# EAGLE design SparkFun_Dev_ESP32_C3_MINI (EAGLE 9.6.2)
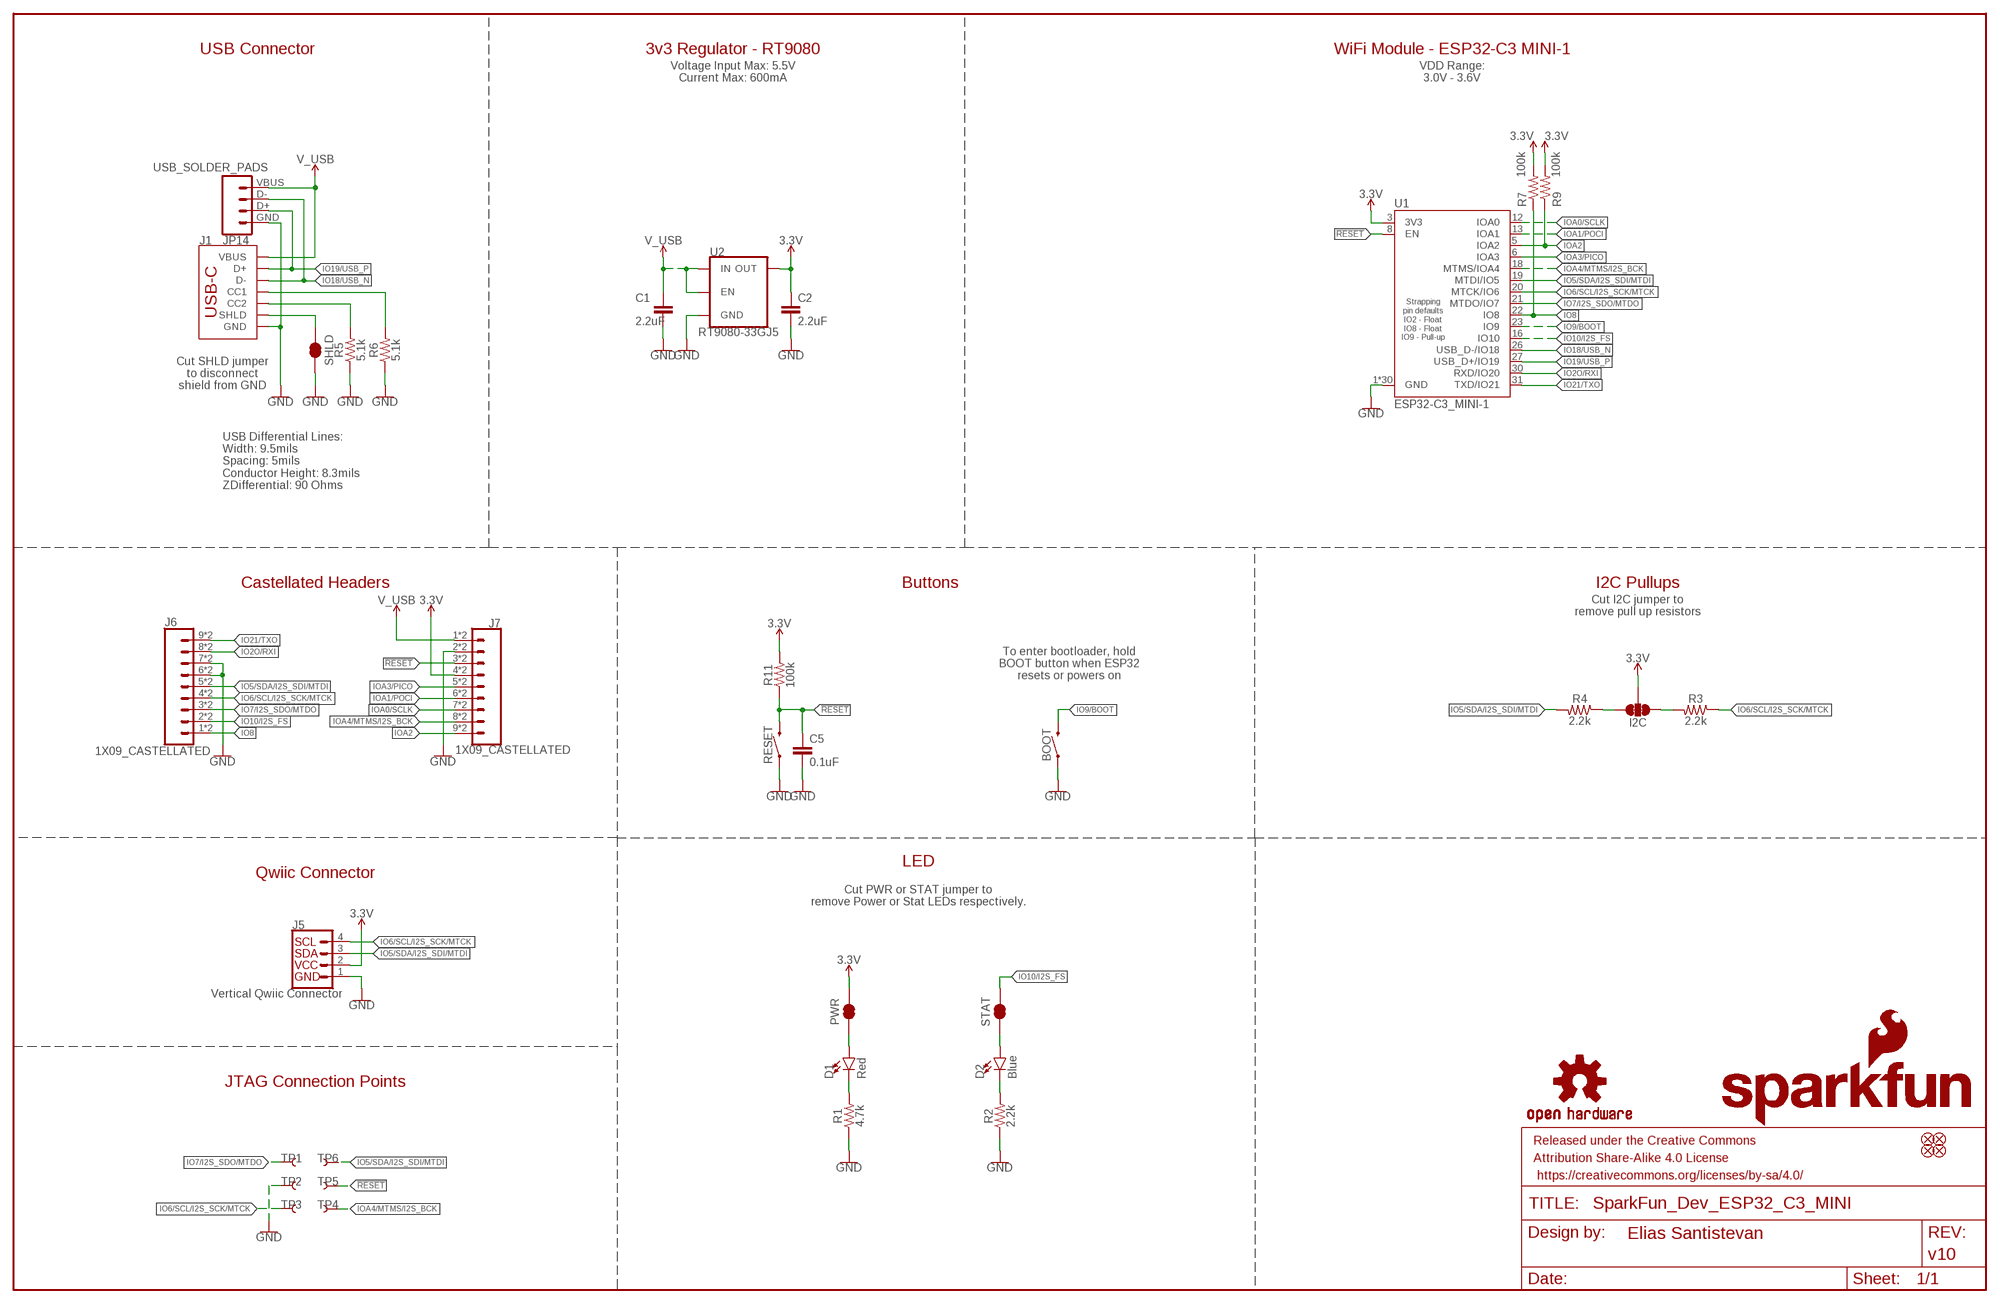
[diagram p0: schematic, sheet 1]

## Parts
BOOT  MOMENTARY-SWITCH-SPST-SMD-4.6X2.8MM  [TACTILE_SWITCH_SMD_4.6X2.8MM]
C1  2.2uF  2.2UF-0402_TIGHT-10V-10%-X5R  [0402-TIGHT]
C2  2.2uF  2.2UF-0402_TIGHT-10V-10%-X5R  [0402-TIGHT]
C5  0.1uF  0.1UF-0402T-6.3V-10%-X7R  [0402-TIGHT]
D1  Red  LED-RED_0603-KB  [LED-0603]
D2  Blue  LED-BLUE0603  [LED-0603]
FD1  FIDUCIALUFIDUCIAL  [FIDUCIAL-MICRO]
FD2  FIDUCIALUFIDUCIAL  [FIDUCIAL-MICRO]
FD3  FIDUCIALUFIDUCIAL  [FIDUCIAL-MICRO]
FD4  FIDUCIALUFIDUCIAL  [FIDUCIAL-MICRO]
FRAME2  FRAME-LEDGER  [CREATIVE_COMMONS]
I2C  JUMPER-SMT_3_2-NC_TRACE_SILK  [SMT-JUMPER_3_2-NC_TRACE_SILK]
J1  USB Female Type C Connector  USB_C_4-LAYER_PADS  [USB-C-16P_4LAYER-PADS]
J5  Vertical Qwiic Connector  QWIIC_CONNECTOR  [JST04_1MM_VERT]
J6  1X09_CASTELLATED  [1X09_CASTELLATED]
J7  1X09_CASTELLATED  [1X09_CASTELLATED]
JP14  USB_SOLDER_PADS  [USB-SOLDER-PADS]
LOGO1  SFE_LOGO_NAME_FLAMEBLANK  [BLANK]
LOGO3  OSHW-LOGOS  [OSHW-LOGO-S]
PWR  JUMPER-SMT_2_NC_TRACE_SILK  [SMT-JUMPER_2_NC_TRACE_SILK]
R1  4.7k  4.7KOHM-0402T-1/16W-1%  [0402-TIGHT]
R2  2.2k  2.2KOHM-0402T-1/16W-1%  [0402-TIGHT]
R3  2.2k  2.2KOHM-0402T-1/16W-1%  [0402-TIGHT]
R4  2.2k  2.2KOHM-0402T-1/16W-1%  [0402-TIGHT]
R5  5.1k  5.1KOHM-0402T-1/16W-1%  [0402-TIGHT]
R6  5.1k  5.1KOHM-0402T-1/16W-1%  [0402-TIGHT]
R7  100k  100KOHM-0402T-1/16W-1%  [0402-TIGHT]
R9  100k  100KOHM-0402T-1/16W-1%  [0402-TIGHT]
R11  100k  100KOHM-0402T-1/16W-1%  [0402-TIGHT]
RESET  MOMENTARY-SWITCH-SPST-SMD-4.6X2.8MM  [TACTILE_SWITCH_SMD_4.6X2.8MM]
SHLD  JUMPER-SMT_2_NC_TRACE_SILK  [SMT-JUMPER_2_NC_TRACE_SILK]
STAT  JUMPER-SMT_2_NC_TRACE_SILK  [SMT-JUMPER_2_NC_TRACE_SILK]
TP1  TEST-POINT3X5  [PAD.03X.05]
TP2  TEST-POINT3X5  [PAD.03X.05]
TP3  TEST-POINT3X5  [PAD.03X.05]
TP4  TEST-POINT3X5  [PAD.03X.05]
TP5  TEST-POINT3X5  [PAD.03X.05]
TP6  TEST-POINT3X5  [PAD.03X.05]
U1  ESP32-C3_MINI-1  [ESP32-C3-MINI-1]
U2  RT9080-33GJ5  V_REG_RT9080  [SOT23-5]

## Nets
3.3V: C2.1 I2C.2 J5.2 J7.4 J7.4B PWR.2 R7.2 R9.2 R11.2 U1.3(3V3) U2.5(OUT)
!RESET!: C5.1 J7.3 J7.3B R11.1 RESET.3 RESET.4 TP5.1 U1.8(EN)
GND: BOOT.1 BOOT.2 C1.2 C2.2 C5.2 J1.GND J1.GND2(GND) J5.1 J6.6 J6.6B J6.7 J6.7B J7.2 J7.2B JP14.GND R1.1 R2.1 R5.1 R6.1 RESET.1 RESET.2 SHLD.2 TP2.1 U1.1(GND) U1.2(GND) U1.11(GND) U1.14(GND) U1.36(GND) U1.37(GND) U1.38(GND) U1.39(GND) U1.40(GND) U1.41(GND) U1.42(GND) U1.43(GND) U1.44(GND) U1.45(GND) U1.46(GND) U1.47(GND) U1.48(GND) U1.49.1(GND) U1.49.2(GND) U1.49.3(GND) U1.49.4(GND) U1.49.5(GND) U1.49.6(GND) U1.49.7(GND) U1.49.8(GND) U1.49.9(GND) U1.50(GND) U1.51(GND) U1.52(GND) U1.53(GND) U2.2(GND)
IO2O/RXI: J6.8 J6.8B U1.30(RXD/IO20)
IO5/SDA/I2S_SDI/MTDI: J5.3 J6.5 J6.5B R4.2 TP6.1 U1.19(MTDI/IO5)
IO6/SCL/I2S_SCK/MTCK: J5.4 J6.4 J6.4B R3.1 TP3.1 U1.20(MTCK/IO6)
IO7/I2S_SDO/MTDO: J6.3 J6.3B TP1.1 U1.21(MTDO/IO7)
IO8: J6.1 J6.1B R7.1 U1.22(IO8)
IO9/BOOT: BOOT.3 BOOT.4 U1.23(IO9)
IO10/I2S_FS: J6.2 J6.2B STAT.2 U1.16(IO10)
IO18/USB_N [USB]: J1.A7(D-) J1.B7(D-) JP14.D- U1.26(USB_D-/IO18)
IO19/USB_P [USB]: J1.A6(D+) J1.B6(D+) JP14.D+ U1.27(USB_D+/IO19)
IO21/TXO: J6.9 J6.9B U1.31(TXD/IO21)
IOA0/SCLK: J7.7 J7.7B U1.12(IOA0)
IOA1/POCI: J7.6 J7.6B U1.13(IOA1)
IOA2: J7.9 J7.9B R9.1 U1.5(IOA2)
IOA3/PICO: J7.5 J7.5B U1.6(IOA3)
IOA4/MTMS/I2S_BCK: J7.8 J7.8B TP4.1 U1.18(MTMS/IOA4)
N$1: D1.C R1.2
N$2: D1.A PWR.1
N$3: D2.C R2.2
N$4: I2C.3 R3.2
N$5: I2C.1 R4.1
N$7: J1.B5(CC2) R5.2
N$8: J1.A5(CC1) R6.2
N$11: D2.A STAT.1
SHLD: J1.SHLD1(SHLD) J1.SHLD2(SHLD) J1.SHLD3(SHLD) J1.SHLD4(SHLD) SHLD.1
V_USB: C1.1 J1.VBUS1(VBUS) J1.VBUS2(VBUS) J7.1 J7.1B JP14.VBUS U2.1(IN) U2.3(EN)

## Notes on the sheet
- USB Connector | 3v3 Regulator - RT9080 | WiFi Module - ESP32-C3 MINI-1
- Voltage Input Max: 5.5V
  Current Max: 600mA
- VDD Range:
  3.0V - 3.6V
- Cut SHLD jumper
  to disconnect
  shield from GND
- USB Differential Lines:  
  Width: 9.5mils
  Spacing: 5mils
  Conductor Height: 8.3mils
  ZDifferential: 90 Ohms
- Castellated Headers | Buttons | I2C Pullups
- Cut I2C jumper to
  remove pull up resistors
- To enter bootloader, hold
  BOOT button when ESP32
  resets or powers on
- LED
- Qwiic Connector
- Cut PWR or STAT jumper to
  remove Power or Stat LEDs respectively.
- JTAG Connection Points

## Library data of the parts
BOOT RESET = SparkFun-Switches:MOMENTARY-SWITCH-SPST: Momentary Switch (Pushbutton) - SPST Normally-open (NO) SPST momentary switches (buttons, pushbuttons). Variants PTH-12MM - 12mm square, through-hole Momentary Pushbutton Switch - 12mm Square <https://www.sparkfun.com/products/9190> (COM-09190) PTH-6.0MM, PTH-6.0MM-KIT - 6.0mm square, through-hole Mini Pushbutton Switch <https://www.sparkfun.com/products/97> (COM-00097) KIT package intended for soldering kit's - only one side of pads' copper is exposed. PTH-RIGHT-ANGLE-KIT - Right-angle, through-hole Right Angle Tactile Button <https://www.sparkfun.com/products/10791> - Used on SparkFun BigTime Watch Kit <https://www.sparkfun.com/products/11734> SMD-12MM - 12mm square, surface-mount Tactile Button - SMD (12mm) <https://www.sparkfun.com/products/12993> (COM-12993) Used on SparkFun PicoBoard <https://www.sparkfun.com/products/11888> SMD-4.5MM - 4.5mm Square Trackball Switch Used on SparkFun Blackberry Trackballer Breakout <https://www.sparkfun.com/products/13169> SMD-4.6MMX2.8MM - 4.60mm x 2.80mm, surface mount Used on SparkFun Pro Micro - RP2040 <https://www.sparkfun.com/products/17717> SMD-5.2MM, SMD-5.2-REDUNDANT - 5.2mm square, surface-mount Mini Pushbutton Switch - SMD <https://www.sparkfun.com/products/8720> (COM-08720) Used on Arduino Pro Mini <https://www.sparkfun.com/products/11114> REDUNDANT package connects both switch circuits together SMD-6.0X3.5MM - 6.0 x 3.5mm, surface mount Momentary Reset Switch SMD <https://www.sparkfun.com/products/8229> (COM-08229) SMD-6.2MM-TALL - 6.2mm square, surface mount Tactile Button - SMD (6mm) <https://www.sparkfun.com/products/12992> Used on SparkFun Digital Sandbox <https://www.sparkfun.com/products/12651> SMD-RIGHT-ANGLE - Right-angle, surface mount Used on SparkFun Block for Intel® Edison - Arduino <https://www.sparkfun.com/products/13036>; PROD_ID: SWCH-15606
C1 C2 = SparkFun-Capacitors:2.2UF: 2.2µF ceramic capacitors A capacitor is a passive two-terminal electrical component used to store electrical energy temporarily in an electric field.; PROD_ID: CAP-14232
C5 = SparkFun-Capacitors:0.1UF: 0.1µF ceramic capacitors A capacitor is a passive two-terminal electrical component used to store electrical energy temporarily in an electric field.; PROD_ID: CAP-14993
D1 = SparkFun-LED:LED-RED: Red SMD LED Used in manufacturing of most products at SparkFun Packages: 0603 - KB - KingBright (DIO-17976) SMD 0603 package [Datasheet] <https://www.kingbrightusa.com/images/catalog/SPEC/APT1608SURCK.pdf> 0603 - (DIO-00819, has gone EOL) SMD 0603 package 0603 SMART - SMD 0603 SMART package ( more efficient and expensive)[Product Link] <http://www.osram-os.com/Graphics/XPic2/00077099_0.pdf> 1206 - SMD1206 package [Product Link] <https://www.sparkfun.com/datasheets/DevTools/LilyPad/Q150OVS4.pdff> SparkFun Products: Pro Mini 328 -5V <https://www.sparkfun.com/products/821> RedBoard <https://www.sparkfun.com/products/12757> IOIO-OTG <https://www.sparkfun.com/products/13613>; PROD_ID: DIO-17976
D2 = SparkFun-LED:LED-BLUE: Blue SMD LED Used in manufacturing of various products at SparkFun Packages: 0603 - SMD 0603 package [Product Link] <http://www.digikey.com/product-detail/en/SMLE12BC7TT86/511-1589-2-ND/1641808> 1206 - SMD1206 package [Product Link] <http://www.digikey.com/product-detail/en/lite-on-inc/LTST-C150TBKT/160-1643-1-ND/573584> SparkFun Products: ESP8266 Thing-Dev Board <https://www.sparkfun.com/products/13711> RedBoard <https://www.sparkfun.com/products/12757>; PROD_ID: DIO-08575
FD1-FD4 = SparkFun-Aesthetics:FIDUCIAL: Fiducial Alignment Points Point-of-reference for pick-and-place machines and other optical instruments.
FRAME2 = SparkFun-Aesthetics:FRAME-LEDGER: Schematic Frame - Ledger Standard 11x14 US Ledger frame; DESIGNER: Elias Santistevan; REV: v10
I2C = SparkFun-Jumpers:JUMPER-SMT_3_2-NC_TRACE: Normally closed trace jumper (2 of 2 connections) This jumper has a trace between all three pads so they are normally closed (NC). Use a razor knife to open the connection(s). For best results follow the IPC guidelines for cutting traces: Cutout at least 0.063 mm (0.005 in). Remove all loose material to clean up the cut area. Seal the cut with an approved epoxy. Reapply solder to reclose the connection(s).
J1 = SparkFun-Connectors:USB_C: USB Type C 16Pin Connector Super Speed pins not available on the 16-pin purely SMD connector so this part is best for USB 2.0 implementations. D1 and D2 are tied together enabling D+/- no matter which way the cable is plugged into the connector. The two channel configuration pins (CC1/2) are exposed. These are normally connected to ground via 5.1k resistors but can be reconfigured for high current/high power applications. **4-LAYER BOARD WARNING!!** If designing 4-layer board, make sure to select the variant _4-LAYER-ISOLATED. The linked footprint (USB-C-16-4LAYER-ISOLATED) includes some very necessary cutout polygons in the inner layers (2 and 15). This prevents the PTH mounting shield legs on the USB connector from electrically connecting any other polygons on the inner layers (usually VCC and GND).; PROD_ID: CONN-14122
J5 = SparkFun-Connectors:QWIIC_CONNECTOR: SparkFun I2C Standard Qwiic Connector An SMD 1mm pitch JST connector makes it easy and quick (get it? Qwiic?) to connect I2C devices to each other. The Qwiic system <http://www.sparkfun.com/qwiic> enables fast and solderless connection between popular platforms and various sensors and actuators. We carry 200mm <https://www.sparkfun.com/products/14204>, 100mm <https://www.sparkfun.com/products/14205>, 50mm <https://www.sparkfun.com/products/14206>, and breadboard friendly <https://www.sparkfun.com/products/14207> Qwiic cables. We also offer 10 pcs strips <https://www.sparkfun.com/products/14323> the SMD connectors.; PROD_ID: CONN-14483
J6 J7 = ESP32-C3-MINI-1:1X09_CASTELLATED
JP14 = SparkFun-Connectors:USB_SOLDER_PADS: Solder pad access to USB pins. Helpful to expose on PCBs so user can attach external USB connector if necessary.
LOGO1 = SparkFun-Aesthetics:SFE_LOGO_NAME_FLAME: SparkFun Font Logo w/ Flame This is the SparkFun full logo. The logo on the schematic will always be the same size; the package variant is the height of the flame part of the logo. Default layer for the logo on the board is tSilk.
LOGO3 = SparkFun-Aesthetics:OSHW-LOGO: Open-Source Hardware (OSHW) Logo This logo indicates the piece of hardware it is found on incorporates a OSHW license and/or adheres to the definition of open source hardware found here: http://freedomdefined.org/OSHW
PWR SHLD STAT = SparkFun-Jumpers:JUMPER-SMT_2_NC_TRACE: Normally closed trace jumper This jumper has a trace between two pads so it's normally closed (NC). Use a razor knife to open the connection. For best results follow the IPC guidelines for cutting traces: Cutout at least 0.063 mm (0.005 in). Remove all loose material to clean up the cut area. Seal the cut with an approved epoxy. Reapply solder to reclose the connection.
R1 = SparkFun-Resistors:4.7KOHM: 4.7kΩ resistor A resistor is a passive two-terminal electrical component that implements electrical resistance as a circuit element. Resistors act to reduce current flow, and, at the same time, act to lower voltage levels within circuits. - Wikipedia; PROD_ID: RES-15343
R2-R4 = SparkFun-Resistors:2.2KOHM: 2.2kΩ resistor A resistor is a passive two-terminal electrical component that implements electrical resistance as a circuit element. Resistors act to reduce current flow, and, at the same time, act to lower voltage levels within circuits. - Wikipedia; PROD_ID: RES-14341
R5 R6 = SparkFun-Resistors:5.1KOHM; PROD_ID: RES-14340
R7 R9 R11 = SparkFun-Resistors:100KOHM: 100kΩ resistor A resistor is a passive two-terminal electrical component that implements electrical resistance as a circuit element. Resistors act to reduce current flow, and, at the same time, act to lower voltage levels within circuits. - Wikipedia; PROD_ID: RES-13495
TP1-TP6 = SparkFun-Connectors:TEST-POINT: SparkFun Test Points Bare copper test points for troubleshooting or In-Circuit-Testing. These are used by our Production team for verifying production board runs using pogo-pins on test beds. SparkFun Products: SparkFun LSM9DS1 Breakout <https://www.sparkfun.com/products/13284> SparkFun PSOC <https://www.sparkfun.com/products/13714> SparkFun Load Cell Amplifier <https://www.sparkfun.com/products/13879>
U1 = ESP32-C3-MINI-1:ESP32-C3_MINI-1: Espressif ESP32C3-MINI-1 ESP32-C3-MINI-1 and ESP32-C3-MINI-1U are two general-purpose Wi-Fi and Bluetooth LE modules. The rich set of peripherals and a small size make the two modules an ideal choice for smart homes, industrial automation, health care, consumer electronics, etc. ESP32-C3-MINI-1 comes with a PCB antenna. ESP32-C3-MINI-1U comes with an external antenna connector. A wide selection of module variants are available as shown in Table 1 and 2. The series comparison for the two modules is as follows:; PROD_ID: IC-20056
U2 = SparkFun-IC-Power:V_REG_RT9080; PROD_ID: VREG-19034

## Net classes
1 Power: width 0.127 mm, clearance 0.178 mm
2 USB: width 0.178 mm, clearance 0.127 mm

## Board
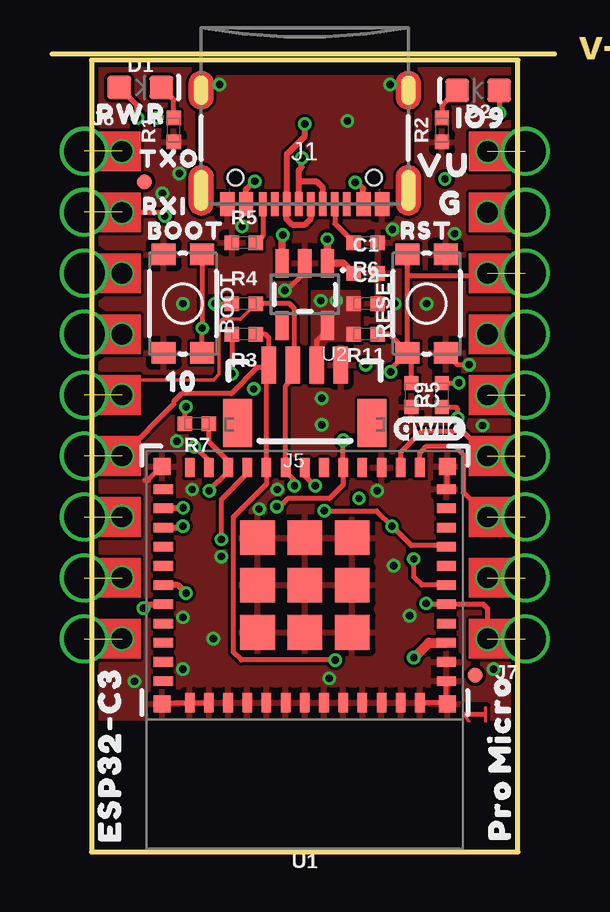
[diagram p1: board, top side]
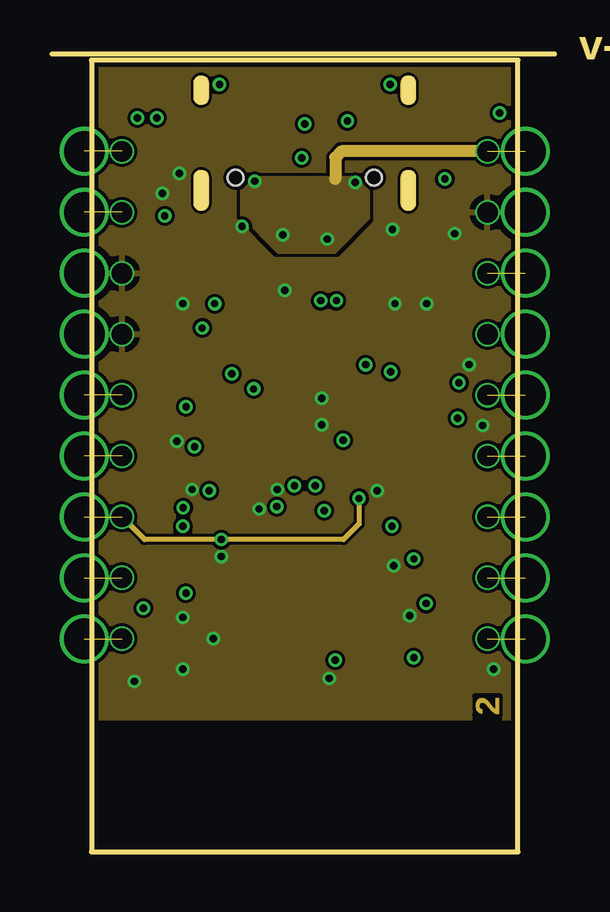
[diagram p2: board, inner layer Route2]
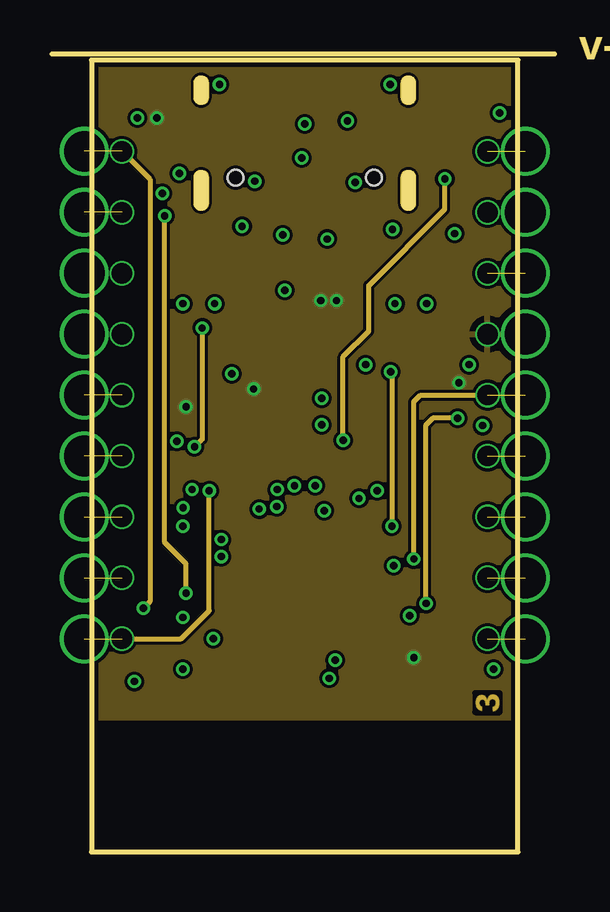
[diagram p3: board, inner layer Route15]
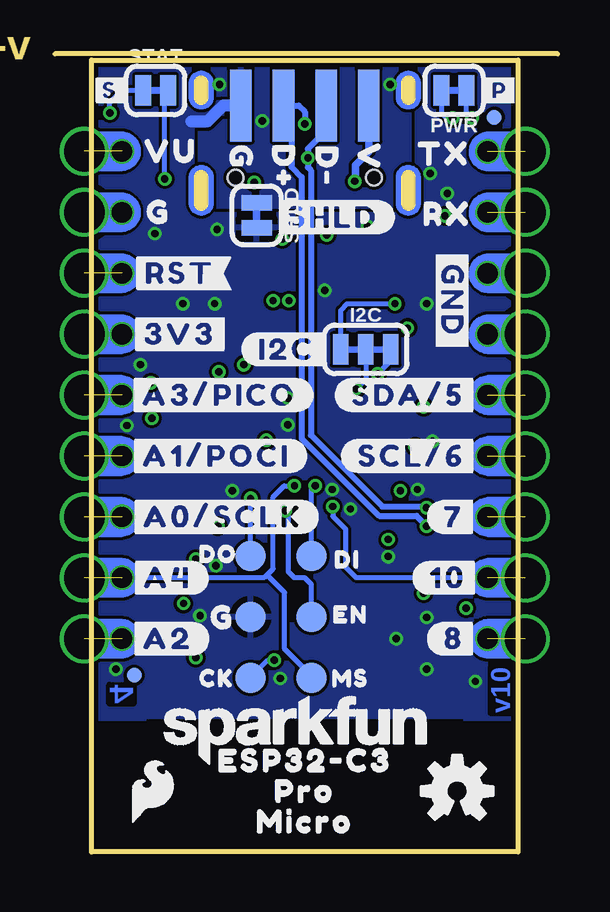
[diagram p4: board, bottom side, seen from below]

Size 17.78 x 33.02 mm. Coordinates in mm from the lower left corner, seen from the top.
Outline: 0,33.02 0,0 17.78,0 17.78,33.02 0,33.02
Copper layers (1*2*15*16): Top 0.035559375mm / dielectric 0.47751875mm / Route2 0.035559375mm / dielectric 0.47751875mm / Route15 0.035559375mm / dielectric 0.47751875mm / Bottom 0.035559375mm
Design rules "SparkFun-4-Layer-Minimum-JLCPCB *": minimum track width 5mil, minimum drill 0.2mm, track to track 5mil, track to pad 5mil, pad to pad 5mil, via to via 5mil, smd to smd 5mil, copper to edge 7mil, drill to drill 7mil, minimum pad ring 3mil, minimum via ring 5mil, stop-mask expansion 2.5mil, vias tented up to drill 25mil, thermal gap 10mil
Milling: 1 lines

### Footprints (pad centres in the part's own frame; a part is rotated, then mirrored left to right if it is on the bottom)
TACTILE_SWITCH_SMD_4.6X2.8MM = smd 0.9 x 1: 1 -2.05,-0.8; 2 2.05,-0.8; 3 2.05,0.8; 4 -2.05,0.8
0402-TIGHT = smd 0.6 x 0.6: 1 -0.5,0; 2 0.5,0
LED-0603 = smd 1 x 1: A -0.877,0; C 0.877,0
FIDUCIAL-MICRO = smd 0.635 x 0.635: 1 0,0
SMT-JUMPER_3_2-NC_TRACE_SILK = smd 0.66 x 1.27: 1 -1.041,0; 2 0,0; 3 1.041,0
USB-C-16P_4LAYER-PADS = smd 0.3 x 1: A5 -1.25,-0.34; A6 -0.25,-0.34; A7 0.25,-0.34; A8 1.25,-0.34; B5 1.75,-0.34; B6 0.75,-0.34; B7 -0.75,-0.34; B8 -1.75,-0.34 | smd 0.6 x 1: GND -3.225,-0.34; GND2 3.225,-0.34; VBUS1 -2.45,-0.34; VBUS2 2.45,-0.34 | drill 0.4 pad 0.6 long: SHLD1 -4.318,-0.915; SHLD2 4.318,-0.915; SHLD3 -4.318,-5.095; SHLD4 4.318,-5.095 | hole 0.65: -2.89,-1.445; 2.89,-1.445
JST04_1MM_VERT = smd 0.6 x 1.55: 1 -1.5,0.775; 2 -0.5,0.775; 3 0.5,0.775; 4 1.5,0.775 | smd 1.2 x 2: NC1 -2.8,3.2; NC2 2.8,3.2
1X09_CASTELLATED = drill 0.85 pad 1.016: 1 0,0; 2 0,2.54; 3 0,5.08; 4 0,7.62; 5 0,10.16; 6 0,12.7; 7 0,15.24; 8 0,17.78; 9 0,20.32 | drill 1.7 pad 1.75: 1B -1.57,0; 2B -1.57,2.54; 3B -1.57,5.08; 4B -1.57,7.62; 5B -1.57,10.16; 6B -1.57,12.7; 7B -1.57,15.24; 8B -1.57,17.78; 9B -1.57,20.32
USB-SOLDER-PADS = smd 3 x 0.9: D+ 0,-0.889; D- 0,0.889; GND 0,-2.667; VBUS 0,2.667
SMT-JUMPER_2_NC_TRACE_SILK = smd 0.66 x 1.27: 1 -0.521,0; 2 0.521,0
PAD.03X.05 = smd 1.27 x 1.27: 1 0,0
ESP32-C3-MINI-1 = smd 0.8 x 0.4: 1 -5.9,4; 2 -5.9,3.2; 3 -5.9,2.4; 4 -5.9,1.6; 5 -5.9,0.8; 6 -5.9,0; 7 -5.9,-0.8; 8 -5.9,-1.6; 9 -5.9,-2.4; 10 -5.9,-3.2; 11 -5.9,-4; 25 5.9,-4; 26 5.9,-3.2; 27 5.9,-2.4; 28 5.9,-1.6; 29 5.9,-0.8; 30 5.9,0; 31 5.9,0.8; 32 5.9,1.6; 33 5.9,2.4; 34 5.9,3.2; 35 5.9,4 | smd 0.4 x 0.8: 12 -4.8,-4.9; 13 -4,-4.9; 14 -3.2,-4.9; 15 -2.4,-4.9; 16 -1.6,-4.9; 17 -0.8,-4.9; 18 0,-4.9; 19 0.8,-4.9; 20 1.6,-4.9; 21 2.4,-4.9; 22 3.2,-4.9; 23 4,-4.9; 24 4.8,-4.9; 36 4.8,4.9; 37 4,4.9; 38 3.2,4.9; 39 2.4,4.9; 40 1.6,4.9; 41 0.8,4.9; 42 0,4.9; 43 -0.8,4.9; 44 -1.6,4.9; 45 -2.4,4.9; 46 -3.2,4.9; 47 -4,4.9; 48 -4.8,4.9 | smd 1.45 x 1.45: 49.1 -1.975,1.975; 49.2 -1.975,0; 49.3 -1.975,-1.975; 49.4 0,-1.975; 49.5 1.975,-1.975; 49.6 1.975,0; 49.7 1.975,1.975; 49.8 0,1.975; 49.9 0,0 | smd 0.7 x 0.7: 50 5.95,4.95; 51 5.95,-4.95; 52 -5.95,-4.95; 53 -5.95,4.95
SOT23-5 = smd 0.55 x 1.2: 1 -0.95,-1.3; 2 0,-1.3; 3 0.95,-1.3; 4 0.95,1.3; 5 -0.95,1.3

### Placement (x,y rotation side)
BOOT  3.81,22.86 270 top
C1  11.43,24.13 0 top
C2  11.43,22.86 0 top
C5  13.34,19.05 270 top
D1  2.03,31.88 0 top
D2  16.12,31.75 180 top
FD1  0.99,30.63 0 bottom
FD2  2.21,27.94 0 top
FD3  16,7.37 0 top
FD4  16,7.37 0 bottom
FRAME2  -12.7,-25.4 0 top  (outside the outline)
I2C  6.35,20.95 0 bottom
J1  8.89,26.67 180 top
J5  8.89,21.08 180 top
J6  1.27,8.89 0 top
J7  16.51,29.21 180 top
JP14  8.89,31.11 270 bottom
LOGO1  -10.16,-25.4 0 top  (outside the outline)
LOGO3  2.54,2.54 0 bottom
PWR  2.67,31.75 180 bottom
R1  3.43,30.1 90 top
R2  14.61,30.1 90 top
R3  6.35,21.59 180 top
R4  6.35,22.86 0 top
R5  6.35,25.4 0 top
R6  11.43,25.4 180 top
R7  4.39,17.86 180 top
R9  14.61,19.05 90 top
R11  11.43,21.59 180 top
RESET  13.97,22.86 90 top
SHLD  10.9,26.54 270 bottom
STAT  15.11,31.75 0 bottom
TP1  11.16,12.34 0 bottom
TP2  11.16,9.8 0 bottom
TP3  11.16,7.26 0 bottom
TP4  8.62,7.26 0 bottom
TP5  8.62,9.8 0 bottom
TP6  8.62,12.34 0 bottom
U1  8.89,11.13 180 top
U2  8.89,23.24 180 top
U$1  [G36]  14.99,26.67 0 bottom
U$4  [#3V3#0]  14.1,21.59 0 bottom
U$5  [RST41]  13.97,25.91 0 top
U$6  [#I2C#947]  9.65,20.95 0 bottom
U$7  [#P#49]  0.76,31.75 0 bottom
U$8  [#S#51]  17.02,31.75 0 bottom
U$9  [#RST#945]  14.1,24.13 0 bottom
U$10  [VU35]  14.48,29.21 0 bottom
U$11  [#SHLD#946]  7.72,26.47 0 bottom
U$12  [#8#50]  2.67,8.89 0 bottom
U$13  [#A1#POCI#50]  12.57,16.51 0 bottom
U$14  [#A0#SCLK#50]  12.32,13.97 0 bottom
U$15  [#A4#50]  14.61,11.43 0 bottom
U$16  [#A2#50]  14.61,8.89 0 bottom
U$17  [TX40]  3.07,29.11 0 bottom
U$18  [SFE_LOGO_NAME_.1]  9.27,5.08 0 bottom
U$20  [#7#50]  2.67,13.97 0 bottom
U$21  [#10#50]  2.92,11.43 0 bottom
U$22  [#GND#4]  2.74,22.99 270 bottom
U$23  [CK39]  12.57,7.24 0 bottom
U$24  [ORDERING_INSTRUCTIONS]  35.56,50.8 0 top  (outside the outline)
U$25  [D#33]  9.78,28.57 270 bottom
U$26  [D#34]  7.98,28.57 270 bottom
U$27  [DI36]  7.11,12.19 0 bottom
U$28  [DO35]  12.5,12.42 0 bottom
U$29  [EN37]  6.99,9.91 0 bottom
U$30  [MS38]  6.99,7.24 0 bottom
U$31  [G36]  11.56,28.96 270 bottom
U$32  [V35]  6.22,28.96 270 bottom
U$33  [G36]  12.32,9.78 0 bottom
U$34  [ESP32#C32]  8.89,3.81 0 bottom
U$35  [PRO0]  8.89,2.54 0 bottom
U$36  [MICRO1]  8.89,1.27 0 bottom
U$37  [RX39]  2.95,26.59 0 bottom
U$38  [10950]  3.76,19.61 0 top
U$39  [G36]  14.99,27.05 0 top
U$40  [#A3#PICO#45]  12.45,19.05 0 bottom
U$41  [BOOT15]  3.94,25.91 0 top
U$42  [RXI39]  3.05,26.92 0 top
U$43  [TXO40]  3.25,28.91 0 top
U$44  [#SDA#5#10952]  4.57,19.05 0 bottom
U$45  [ESP32#C32]  0.76,4.06 90 top
U$46  [PRO0]  17.02,1.78 90 top
U$47  [MICRO1]  17.02,5.33 90 top
U$48  [SFE_LOGO_FLAME_.1]  15.24,2.54 0 bottom
U$49  [PWR945]  1.65,30.76 0 top
U$50  [QWIIC_3MM]  14.1,17.65 0 top
U$51  [VU35]  14.68,28.63 0 top
U$52  [IO944]  16.23,30.61 0 top
U$53  [#SCL#6#10952]  4.45,16.51 0 bottom

### Tracks (layer width: path | path; a pad name or v marks a point on that pad's centre or on a via)
3.3V  (via drill 0.3)
  Top 0.203: J5.2 9.39,21.32 9.81,21.74 | R9.2 15.31,19.55 v15.32,19.56 | v3.94,18.57 3.89,18.52 R7.2
  Top 0.305: 9.81,21.74 9.81,21.96 9.84,21.99 U2.5
  Top 0.406: v13.44,8.1 14.06,8.72 U1.3
  Bottom 0.203: I2C.2 6.35,19.71 v6.76,19.3 | PWR.2 3.19,30.82 2.98,30.61 v2.72,30.61
  other vias: 10.21,22.99 9.55,22.99
  pour Route15 (rank 4): 0,33.02 17.78,33.02 17.78,5.59 0,5.59
  pour Top (no thermals): 9.19,19.56 9.65,19.56 9.65,21.08 9.91,21.34 11.18,21.34 11.18,23.37 9.19,23.37
!RESET!  (via drill 0.3)  (1 unrouted)
  Top 0.203: R11.1 12.39,21.59 RESET.4 | RESET.4 13.17,24 | 13.17,24 RESET.3 | v12.47,20.02 12.47,20.12 RESET.4 | U1.8 14.74,12.78 13.34,12.78 v12.52,13.59 11.89,14.22 v9.7,14.22 | C5.1 13.34,20.64 RESET.4 | J7.3 16.38,24 13.17,24
  Route15 0.203: v12.47,20.02 12.52,19.96 v12.52,13.59
  Bottom 0.203: v9.7,14.22 9.58,14.1 9.58,11.68 9.32,11.43 8.89,11.43 8.62,11.16 TP5.1
GND  (via drill 0.3)
  Top 0.2: 14.79,6.22 U1.1 | U1.53 14.79,6.22 | 14.79,6.22 U1.48 | U1.50 2.99,6.22 U1.37 | U1.11 14.84,15.18 U1.52 | U1.51 2.36,15.5 2.23,15.5
  Top 0.203: 8.89,24.21 8.89,24.16 8.15,23.42 | RESET.1 15.26,20.32 v15.75,20.32
  Top 0.254: U2.2 8.89,24.21
  Bottom 0.508: JP14.GND 12.29,31.11 12.96,30.45 13.62,30.45
  other vias: 8.05,23.42 3.56,17.12 3.81,22.86 13.97,22.86 3.81,7.62 1.78,7.11 3.66,28.3 12.65,22.86 9.59,18.91 6.27,26.09 12.55,25.96 2.95,27.46 16.76,7.62 11.91,15.06 3.81,9.78 5.08,8.89 7.75,15.11 13.26,9.86 16.31,17.78 4.19,15.11 15.14,25.78 9.91,7.24 12.6,11.94 6.99,14.3 5.41,12.32 9.6,17.81
  pour Top (rank 4): 0,33.02 17.78,33.02 17.78,5.59 0,5.59
  pour Bottom (rank 4): 0,33.02 17.78,33.02 17.78,5.59 0,5.59
  pour Route2 (rank 4): 0,33.02 17.78,33.02 17.78,5.59 0,5.59
IO2O/RXI  (via drill 0.3)  (1 unrouted)
  Top 0.203: J6.8 2.9,26.67 v3.05,26.52
  Top 0.254: v3.94,10.79 3.61,11.12 U1.30
  Route15 0.203: v3.94,10.79 3.94,12.01 3.05,12.9 v3.05,26.52
IO5/SDA/I2S_SDI/MTDI  (via drill 0.3)  (1 unrouted)
  Top 0.152: R4.2 6.21,22.23 5.46,22.23 5.32,22.09 5.32,19.93 5.08,19.68 1.9,19.68
  Top 0.203: 6.9,22.91 R4.2 8.26,22.86 8.44,22.67 8.44,20.36 J5.3 8.39,19.74 8.09,19.44 U1.19 8.09,15.85 8.46,15.48 v8.46,15.27 | 1.9,19.68 J6.5
  Bottom 0.203: TP6.1 8.62,15.1 v8.46,15.27
IO6/SCL/I2S_SCK/MTCK  (via drill 0.3)  (1 unrouted)
  Top 0.203: J5.4 7.29,20.21 U1.20 7.29,15.34 5.92,13.97 5.92,8.33 6.25,8 v10.16,8 | J5.4 7.39,21.43 7.23,21.59 R3.1 | J5.4 7.28,20.19 6.91,20.19 5.83,19.11 3.76,19.11 3.43,18.78 3.43,18.67 J6.4
  Bottom 0.203: TP3.1 10.41,8 v10.16,8
IO7/I2S_SDO/MTDO  (via drill 0.3)  (1 unrouted)
  Top 0.203: 6.49,15.76 U1.21 6.49,15.79 5.41,14.71 v5.41,13.03
  Route2 0.203: J6.3 2.21,13.03 v5.41,13.03 10.51,13.03 11.15,13.67 v11.15,14.74
  Bottom 0.203: TP1.1 v11.16,14.73 v11.15,14.74
IO8  (via drill 0.3)  (1 unrouted)
  Top 0.203: 5.69,16.32 U1.22 | U1.22 5.69,16.3 4.89,17.09 R7.1 | U1.22 5.69,15.85 v4.9,15.06
  Route15 0.203: J6.1 3.73,8.89 4.9,10.06 v4.9,15.06
IO9/BOOT  (via drill 0.3)
  Top 0.203: BOOT.4 v4.61,21.84 BOOT.3 | U1.23 4.89,16.29 v4.29,16.89
  Route15 0.203: v4.61,21.84 4.61,17.21 v4.29,16.89
IO10/I2S_FS  (via drill 0.3)  (1 unrouted)
  Top 0.203: v10.49,17.17 10.49,17.12 U1.16 10.49,15.3 9.92,14.73 8.18,14.73 7.85,14.4 v7.72,14.4
  Route15 0.203: v10.49,17.17 10.49,20.65 11.56,21.72 11.56,23.62 14.73,26.8 v14.73,28.07
  Bottom 0.203: 15.21,31.75 STAT.2 14.73,31.61 v14.73,28.07 | J6.2 6.73,11.43 7.19,11.89 7.19,13.46 7.72,13.99 v7.72,14.4
IO18/USB_N  (via drill 0.3)
  Top 0.241: J1.B7 9.64,27.7 9.4,27.94 8.64,27.94 J1.A7 8.64,28.43 8.76,28.55 v8.76,28.93 | v3.82,14.35 3.79,14.32 U1.26
  Bottom 0.241: JP14.D- 8,30.07 8.76,29.32 v8.76,28.93 8.76,28.54 8.64,28.42 8.64,17.38 5.66,14.4 3.87,14.4 v3.82,14.35
IO19/USB_P  (via drill 0.3)
  Top 0.241: J1.A6 9.14,26.41 8.89,26.16 8.35,26.16 8.11,26.41 8.11,26.98 J1.B6 8.14,29.09 8.89,29.84 v8.89,30.35 | U1.27 3.75,13.53 v3.81,13.59
  Bottom 0.241: v8.89,30.35 8.89,30.86 9.14,31.11 JP14.D+ 9.45,30.79 9.45,28.57 9.02,28.14 9.02,17.23 5.79,14.01 4.23,14.01 v3.81,13.59
IO21/TXO  (via drill 0.3)  (1 unrouted)
  Top 0.254: v2.16,10.16 2.32,10.32 U1.31
  Route15 0.203: J6.9 2.44,28.04 2.44,10.44 v2.16,10.16
IOA0/SCLK  (1 unrouted)
  Top 0.203: J7.7 15.49,14.99 15.49,16.56 15.14,16.92 13.97,16.92 13.77,16.71 13.69,16.64 U1.12
IOA1/POCI  (1 unrouted)
  Top 0.203: U1.13 12.89,16.68 13.77,17.55 15.47,17.55 J7.6
IOA2  (via drill 0.3)  (1 unrouted)
  Top 0.203: J7.9 16.51,10.16 16.34,10.32 U1.5 13.95,10.32 v13.95,10.36 | v15.27,18.09 15.27,18.47 15.18,18.55 R9.1
  Route15 0.203: v15.27,18.09 14.22,18.09 13.95,17.8 v13.95,10.36
IOA3/PICO  (via drill 0.3)  (1 unrouted)
  Top 0.203: U1.6 13.77,11.12 13.44,11.46 v13.44,12.22
  Route15 0.203: v13.44,12.22 13.44,18.77 13.72,19.05 J7.5
IOA4/MTMS/I2S_BCK  (via drill 0.3)  (1 unrouted)
  Top 0.203: U1.18 8.88,16.02 8.88,15.71 v9.32,15.27
  Bottom 0.203: v9.32,15.27 9.75,15.27 10.21,14.81 10.21,11.81 10.46,11.56 | 10.46,11.56 10.59,11.43 J7.8 | TP4.1 8.62,7.35 9.73,8.46 9.73,10.82 10.46,11.56
N$1
  Top 0.203: R1.2 3.43,31.36 D1.C
N$2  (via drill 0.3)
  Top 0.203: v1.9,30.61 1.9,31.13 D1.A
  Bottom 0.203: v1.9,30.61 2.15,30.85 PWR.1
N$3
  Top 0.203: R2.2 14.61,31.11 D2.C
N$4  (via drill 0.3)
  Top 0.203: R3.2 v5.85,19.95 v5.84,19.94
  Bottom 0.203: I2C.3 5.31,20.47 v5.84,19.94
N$5  (via drill 0.3)
  Top 0.203: R4.1 5.83,22.86 v5.13,22.86
  Bottom 0.203: I2C.1 7.39,22.58 7.11,22.86 v5.13,22.86
N$7
  Top 0.203: J1.B5 7.14,25.69 R5.2
N$8
  Top 0.203: J1.A5 10.14,26.19 R6.2
N$11  (via drill 0.3)
  Top 0.203: D2.A 16.99,30.83 v17.02,30.81
  Bottom 0.203: STAT.1 16.51,31.75 17.02,31.24 v17.02,30.81
N$16  (via drill 0.3)
  other vias: 11.43,20.32
SHLD  (via drill 0.3)
  other vias: 10.67,30.48 5.33,32 12.45,32
  pour Top (no thermals): 4.57,32.26 4.57,27.05 13.22,27.05 13.22,32.26
  pour Bottom (no thermals): 4.57,33.02 4.57,26.92 13.21,26.92 13.21,33.02
V_USB  (via drill 0.3)  (1 unrouted)
  Top 0.254: J1.VBUS1 11.32,27.03 11.32,27.67 11.08,27.91 v11,27.91 | J1.VBUS2 6.44,27.62 6.78,27.96 v6.81,27.96
  Top 0.305: v9.83,25.55 v9.84,25.54 U2.1 10.47,24.54 10.89,24.13 C1.1 | U2.3 7.94,25.7 v7.98,25.73
  Route2 0.508: 10.16,28.07 10.16,28.96 10.41,29.21 J7.1
  Bottom 0.305: v6.81,27.96 6.78,27.99 6.78,28.64 6.22,29.2 JP14.VBUS
  pour Route2 (no thermals): 6.22,27.56 6.22,26.54 7.75,25.02 10.16,25.02 11.56,26.42 11.56,27.56 10.98,28.12 6.83,28.12 6.27,27.56

### Text on the board
Top: 1
Route2: 2
Route15: 3
Bottom: 4 | v10
Milling: v-score
Measures: Units: inches
tDocu: 4-layer / JLC7628 Stackup / Material: TG135-140 / 1oz outer layers / 0.5oz inner layers / Board thickness: 0.8mm / Soldermask: Red / Silkscreen: White / Surface Finish: Lead-Free HASL / Castellated Leads | Elias Santistevan